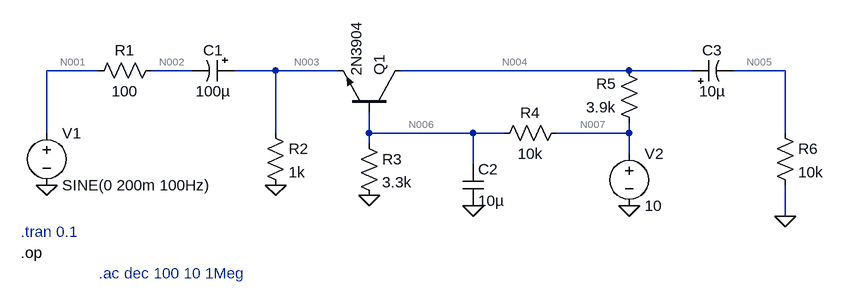
[diagram p0: schematic BJT Cascode Amplifier.asc]
BJT Cascode Amplifier.asc, the LTspice schematic file:
Version 4.1
SHEET 1 1300 680
WIRE 176 0 96 0
WIRE 320 0 256 0
WIRE 448 0 384 0
WIRE 544 0 448 0
WIRE 992 0 640 0
WIRE 1088 0 992 0
WIRE 1232 0 1152 0
WIRE 96 96 96 0
WIRE 448 96 448 0
WIRE 592 96 592 64
WIRE 752 96 592 96
WIRE 800 96 752 96
WIRE 992 96 992 80
WIRE 992 96 880 96
WIRE 1232 96 1232 0
WIRE 592 112 592 96
WIRE 992 128 992 96
WIRE 752 144 752 96
WIRE 1232 224 1232 176
FLAG 96 176 0
FLAG 448 176 0
FLAG 592 192 0
FLAG 752 208 0
FLAG 1232 224 0
FLAG 992 208 0
SYMBOL voltage 96 80 R0
WINDOW 123 0 0 Left 0
WINDOW 39 0 0 Left 0
SYMATTR InstName V1
SYMATTR Value SINE(0 200m 100Hz)
SYMBOL res 272 -16 R90
WINDOW 0 0 56 VBottom 2
WINDOW 3 32 56 VTop 2
SYMATTR InstName R1
SYMATTR Value 100
SYMBOL polcap 384 -16 R90
WINDOW 0 0 32 VBottom 2
WINDOW 3 32 32 VTop 2
SYMATTR InstName C1
SYMATTR Value 100µ
SYMBOL res 432 80 R0
SYMATTR InstName R2
SYMATTR Value 1k
SYMBOL res 576 96 R0
SYMATTR InstName R3
SYMATTR Value 3.3k
SYMBOL npn 640 64 M270
SYMATTR InstName Q1
SYMATTR Value 2N3904
SYMBOL res 896 80 R90
WINDOW 0 0 56 VBottom 2
WINDOW 3 32 56 VTop 2
SYMATTR InstName R4
SYMATTR Value 10k
SYMBOL res 1008 96 R180
WINDOW 0 36 76 Left 2
WINDOW 3 36 40 Left 2
SYMATTR InstName R5
SYMATTR Value 3.9k
SYMBOL cap 736 144 R0
SYMATTR InstName C2
SYMATTR Value 10µ
SYMBOL polcap 1088 16 R270
WINDOW 0 32 32 VTop 2
WINDOW 3 0 32 VBottom 2
SYMATTR InstName C3
SYMATTR Value 10µ
SYMBOL res 1216 80 R0
SYMATTR InstName R6
SYMATTR Value 10k
SYMBOL voltage 992 112 R0
WINDOW 123 0 0 Left 0
WINDOW 39 0 0 Left 0
SYMATTR InstName V2
SYMATTR Value 10
TEXT 56 248 Left 2 ;.tran 0.1
TEXT 56 280 Left 2 !.op
TEXT 176 312 Left 2 ;.ac dec 100 10 1Meg

The netlist it stands for:
* BJT Cascode Amplifier.asc
V1 N001 0 SINE(0 200m 100Hz)
R1 N002 N001 100
C1 N003 N002 100µ
R2 N003 0 1k
R3 N006 0 3.3k
Q1 N004 N006 N003 0 2N3904
R4 N007 N006 10k
R5 N007 N004 3.9k
C2 N006 0 10µ
C3 N004 N005 10µ
R6 N005 0 10k
V2 N007 0 10
.model NPN NPN
.model PNP PNP
.lib standard.bjt
* .tran 0.1
.op
* .ac dec 100 10 1Meg
.backanno
.end

* Results of the author's LTspice run, read from the files saved beside the schematic
* Operating Point:
*   V(n001) = 0 V
*   V(n002) = 17.96 fV
*   V(n003) = 1.796 V
*   V(n004) = 3.019 V
*   V(n005) = 301.9 fV
*   V(n006) = 2.466 V
*   V(n007) = 10 V
*   I(C1) = 0 A
*   I(C2) = 0 A
*   I(C3) = 0 A
*   I(R1) = 0 A
*   I(R2) = 1.796 mA
*   I(R3) = 747.4 µA
*   I(R4) = 753.4 µA
*   I(R5) = 1.79 mA
*   I(R6) = 0 A
*   I(V1) = 0 A
*   I(V2) = -2.543 mA
*   Ib(Q1) = 5.96 µA
*   Ic(Q1) = 1.79 mA
*   Ie(Q1) = -1.796 mA
*   Is(Q1) = 0 A